# EAGLE design leaf_type_02_rev_01 (EAGLE 7.3.0)
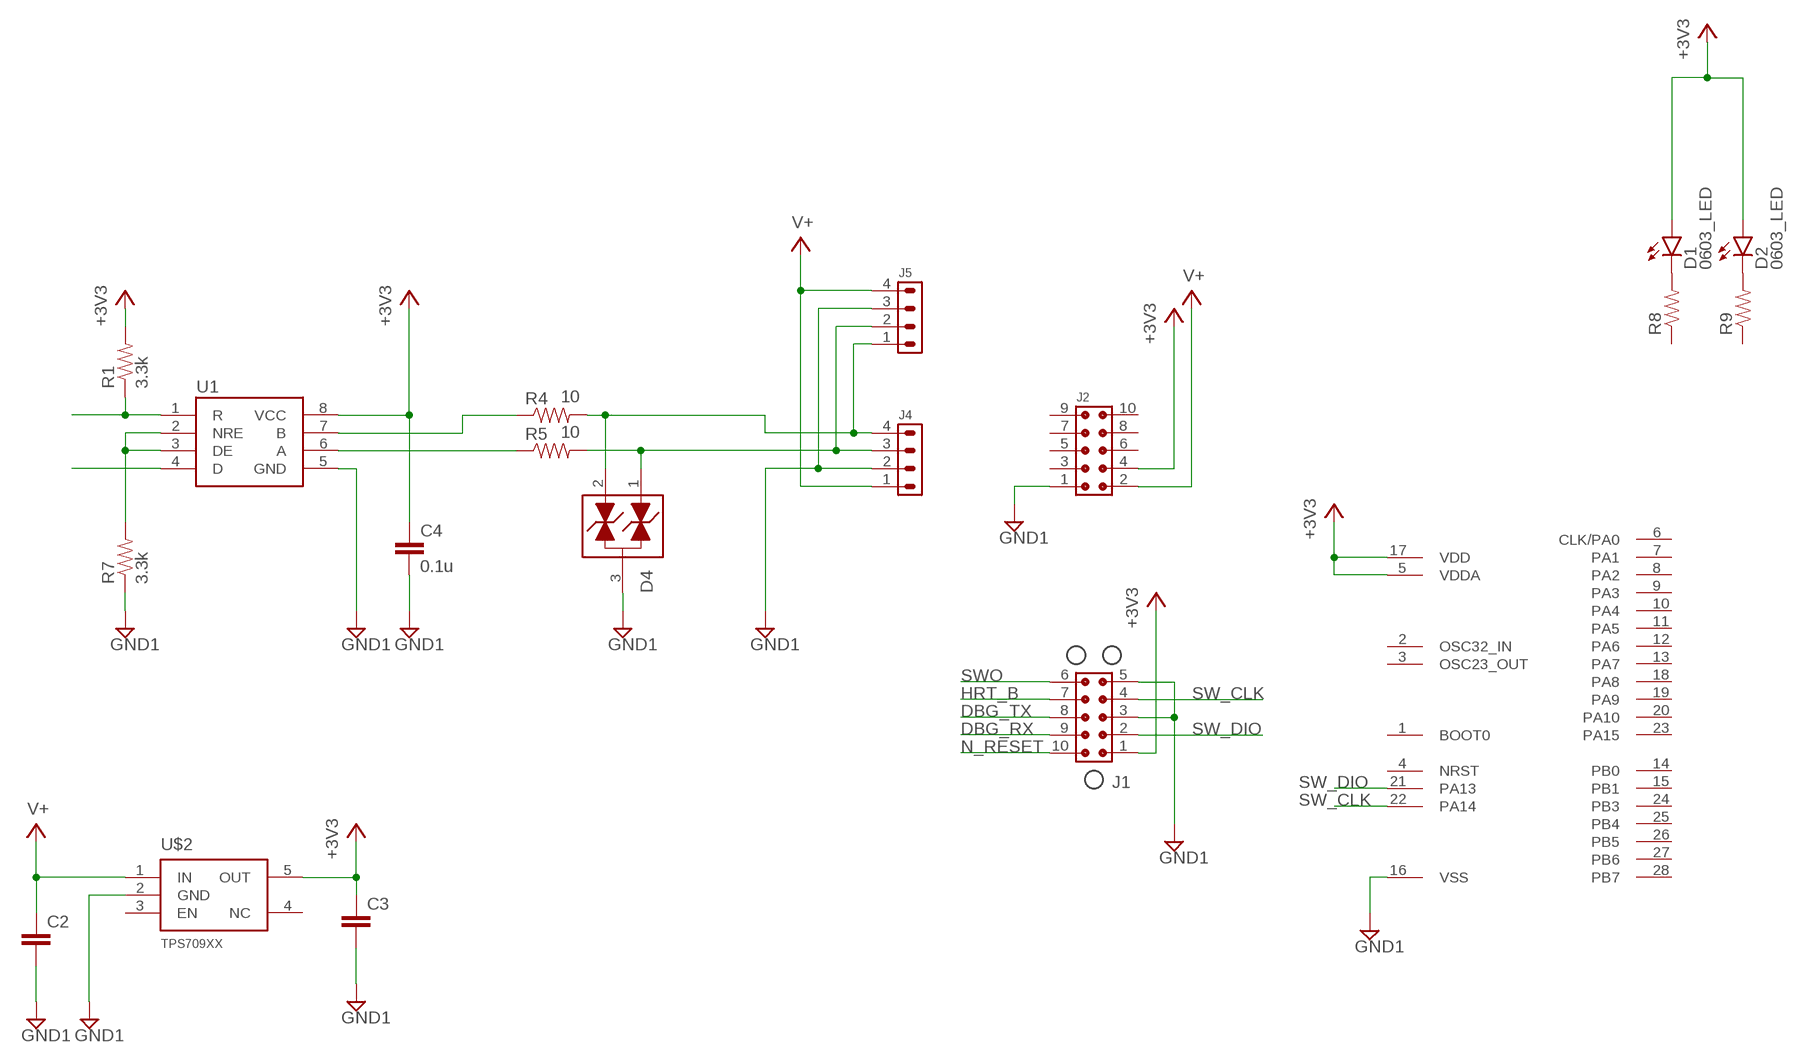
[diagram p0: schematic, sheet 1]

## Parts
C2  0603_CAP  [0603]
C3  0603_CAP  [0603]
C4  0.1u  0603_CAP  [0603]
D1  0603_LED  [0603_LED]
D2  0603_LED  [0603_LED]
D4  TVS_SOT-23  [SOT-23_ONSEMI]
J1  TC_2050_IDC_NL_TOP  [TC_2050_IDC_NL_TOP]
J2  CONN_5X2_0P05_IN_SMT  [CONN_5X2_0P050_IN_SMT]
J4  CONN_4X1_JST_PA  [CONN_4X1_JST_PA]
J5  CONN_4X1_JST_PA  [CONN_4X1_JST_PA]
R1  3.3k  0402_RES  [0402]
R4  10  0603_RES  [0603]
R5  10  0603_RES  [0603]
R7  3.3k  0603_RES  [0603]
R8  0603_RES  [0603]
R9  0603_RES  [0603]
U1  RS485_XCVR_SN65HVD178X  [SOIC_08_TI]
U2  STM32L031G6U6  [STM32_QFN_28_4X4]
U$2  TPS709XX  [SOT23-5]

## Nets
+3V3: C3.P$1 C4.P$1 D1.P$1(A) D2.P$1(A) J1.1 J2.4 R1.P$2 U1.8(VCC) U2.5(VDDA) U2.17(VDD) U$2.5(OUT)
DBG_RX: J1.9
DBG_TX: J1.8
GND1: C2.P$2 C3.P$2 C4.P$2 D4.3 J1.3 J1.5 J2.1 J4.2 J5.3 R7.P$1 U1.5(GND) U2.16(VSS) U$2.2(GND)
HRT_B: J1.7
N$1: D4.2 J4.4 J5.1 R4.P$2
N$2: D1.P$2(C) R8.P$2
N$3: D2.P$2(C) R9.P$2
N$6: R4.P$1 U1.7(B)
N$7: D4.1 J4.3 J5.2 R5.P$2
N$9: R5.P$1 U1.6(A)
N$10: R7.P$2 U1.2(NRE) U1.3(DE)
N$12: R1.P$1 U1.1(R)
N$13: U1.4(D)
N_RESET: J1.10
SW_CLK: J1.4 U2.22(PA14)
SW_DIO: J1.2 U2.21(PA13)
SWO: J1.6
V+: C2.P$1 J2.2 J4.1 J5.4 U$2.1(IN)
Unconnected: J2.3 J2.5 J2.6 J2.7 J2.8 J2.9 J2.10 R8.P$1 R9.P$1 U2.1(BOOT0) U2.2(OSC32_IN) U2.3(OSC23_OUT) U2.4(NRST) U2.6(CLK/PA0) U2.7(PA1) U2.8(PA2) U2.9(PA3) U2.10(PA4) U2.11(PA5) U2.12(PA6) U2.13(PA7) U2.14(PB0) U2.15(PB1) U2.18(PA8) U2.19(PA9) U2.20(PA10) U2.23(PA15) U2.24(PB3) U2.25(PB4) U2.26(PB5) U2.27(PB6) U2.28(PB7) U$2.3(EN) U$2.4(NC)

## Library data of the parts
C2-C4 = stepOSP:0603_CAP
D1 D2 = stepOSP:0603_LED
D4 = leaf:TVS_SOT-23
J1 = leaf:TC_2050_IDC_NL_TOP
J2 = leaf:CONN_5X2_0P05_IN_SMT
J4 J5 = leaf:CONN_4X1_JST_PA
R1 = stepOSP:0402_RES
R4 R5 R7-R9 = stepOSP:0603_RES
U1 = leaf:RS485_XCVR_SN65HVD178X
U2 = leaf:STM32L031G6U6
U$2 = stepOSP:TPS709XX

## Board
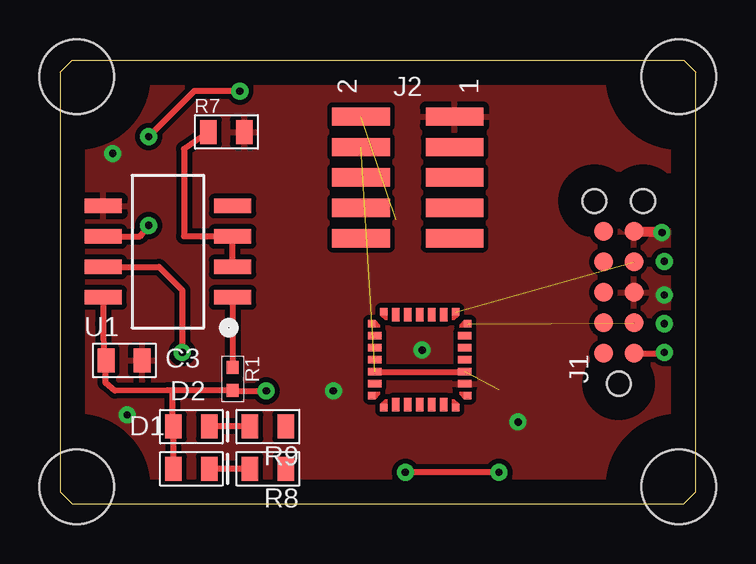
[diagram p1: board, top side]
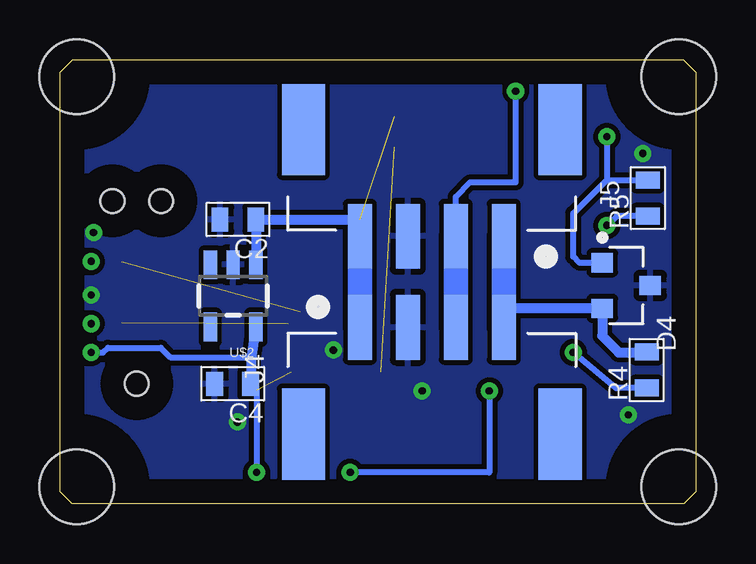
[diagram p2: board, bottom side, seen from below]

Size 26.5 x 18.5 mm. Coordinates in mm from the lower left corner, seen from the top.
Outline: 0,0.5 0.5,0 26,0 26.5,0.5 26.5,18 26,18.5 0.5,18.5 0,18 0,0.5
Copper layers (1*16): Top 0.035mm / dielectric 1.5mm / Bottom 0.035mm
Design rules "default *": minimum track width 10mil, minimum drill 24mil, track to track 8mil, track to pad 8mil, pad to pad 8mil, via to via 8mil, smd to smd 8mil, copper to edge 40mil, drill to drill 8mil, minimum pad ring 10mil, minimum via ring 8mil, stop-mask expansion 4mil, vias tented up to drill 12mil, thermal gap 10mil
Holes 3.1 mm at 25.8,0.7 0.7,17.8 0.7,0.7 25.8,17.8
tRestrict: area -2.3,14.8 to 3.7,20.8; area 22.8,-2.3 to 28.8,3.7; area -2.3,-2.3 to 3.7,3.7; area 22.8,14.8 to 28.8,20.8
bRestrict: area 22.8,14.8 to 28.8,20.8; area 22.8,-2.3 to 28.8,3.7; area -2.3,14.8 to 3.7,20.8; area -2.3,-2.3 to 3.7,3.7

### Footprints (pad centres in the part's own frame; a part is rotated, then mirrored left to right if it is on the bottom)
0603 = smd 0.7 x 1: P$1 -0.75,0; P$2 0.75,0
0603_LED = smd 0.7 x 1: P$1 -0.75,0; P$2 0.75,0
SOT-23_ONSEMI = smd 0.8 x 0.9: 1 -0.95,-1; 2 0.95,-1; 3 0,1
TC_2050_IDC_NL_TOP = smd 0.787 x 0.787: 1 1.27,-0.635; 2 2.54,-0.635; 3 3.81,-0.635; 4 5.08,-0.635; 5 6.35,-0.635; 6 6.35,0.635; 7 5.08,0.635; 8 3.81,0.635; 9 2.54,0.635; 10 1.27,0.635 | hole 0.991: 0,0; 7.62,1.016; 7.62,-1.016
CONN_5X2_0P050_IN_SMT = smd 0.76 x 2.4: 1 -2.54,1.95; 2 -2.54,-1.95; 3 -1.27,1.95; 4 -1.27,-1.95; 5 0,1.95; 6 0,-1.95; 7 1.27,1.95; 8 1.27,-1.95; 9 2.54,1.95; 10 2.54,-1.95
CONN_4X1_JST_PA = smd 1 x 2.7: 1 3,-9.15; 2 1,-9.15; 3 -1,-9.15; 4 -3,-9.15 | smd 1.8 x 3.8: P$1 5.35,-4.7; P$2 -5.35,-4.7
0402 = smd 0.55 x 0.5: P$1 -0.475,0; P$2 0.475,0
SOIC_08_TI = smd 0.6 x 1.55: 1 0,-2.7; 2 1.27,-2.7; 3 2.54,-2.7; 4 3.81,-2.7; 5 3.81,2.7; 6 2.54,2.7; 7 1.27,2.7; 8 0,2.7
STM32_QFN_28_4X4 = smd 0.3 x 0.3: 1 -2,1.5; 7 -2,-1.5; 8 -1.5,-2; 14 1.5,-2; 15 2,-1.5; 21 2,1.5; 22 1.5,2; 28 -1.5,2 | smd 0.55 x 0.3: 2 -1.875,1; 3 -1.875,0.5; 4 -1.875,0; 5 -1.875,-0.5; 6 -1.875,-1; 16 1.875,-1; 17 1.875,-0.5; 18 1.875,0; 19 1.875,0.5; 20 1.875,1 | smd 0.3 x 0.55: 9 -1,-1.875; 10 -0.5,-1.875; 11 0,-1.875; 12 0.5,-1.875; 13 1,-1.875; 23 1,1.875; 24 0.5,1.875; 25 0,1.875; 26 -0.5,1.875; 27 -1,1.875
SOT23-5 = smd 0.55 x 1.2: 1 -0.95,-1.3; 2 0,-1.3; 3 0.95,-1.3; 4 0.95,1.3; 5 -0.95,1.3

### Placement (x,y rotation side)
C2  19.08,11.85 180 bottom
C3  2.68,5.97 0 top
C4  19.3,5 180 bottom
D1  5.48,1.45 0 top
D2  5.48,3.21 0 top
D4  2.89,9.09 270 bottom
J1  23.3,5 90 top
J2  14.5,13.6 270 top
J4  11,-1.8 180 bottom
J5  11,20.3 0 bottom
R1  7.2,5.2 270 top
R4  2.04,5.57 90 bottom
R5  1.99,12.74 90 bottom
R7  6.94,15.5 180 top
R8  8.67,1.45 180 top
R9  8.67,3.21 180 top
U1  4.5,8.6 90 top
U2  15,6 0 top
U$2  19.28,8.66 180 bottom

### Tracks (layer width: path | path; a pad name or v marks a point on that pad's centre or on a via)
+3V3  (via drill 0.3)  (2 unrouted)
  Top 0.254: U1.8 1.8,7.5 1.83,6.07 C3.P$1 1.9,5.04 2.3,4.7 4.47,4.72 4.7,4.72 | 4.7,4.72 R1.P$2 7.22,4.7 v8.6,4.7 | J1.1 25.17,6.27 v25.2,6.3 | 4.8,2.94 D2.P$1 | 4.83,1.35 D1.P$1 D2.P$1 | D2.P$1 4.7,3.14 4.7,4.72 | v18.3,1.3 v14.4,1.3 | U2.5 U2.17
  Bottom 0.254: v25.2,6.3 24.7,6.3 24.5,6.5 22.3,6.5 21.9,6.1 18.59,6.1 18.53,6.04 | C4.P$1 18.3,4.75 v18.3,1.3 | v8.6,4.7 8.6,1.3 v14.4,1.3
  Bottom 0.406: U$2.5 18.35,7.36 18.53,6.04 C4.P$1
GND1  (via drill 0.3)
  Top 0.406: J1.5 25.1,11.35 v25.1,11.3
  other vias: 19.1,3.4 2.2,14.6 25.2,8.7 2.8,3.7 11.4,4.7 15.1,6.4
  pour Bottom: 0,0 26.5,-0.1 26.5,18.5 0,18.5
  pour Top: 0,0 26.5,0 26.5,18.5 0,18.5
N$1
  Bottom 0.406: 8,8.2 7.94,8.14 D4.2 3.89,6.99 3.2,6.3 2.06,6.3 R4.P$2
  Bottom 1.016: J4.4 8,8.2 J5.1
N$2
  Top 0.254: R8.P$2 D1.P$2
N$3
  Top 0.254: R9.P$2 D2.P$2
N$6  (via drill 0.3)
  Top 0.254: U1.7 4.13,9.87 5.1,8.9 v5.1,6.3
  Bottom 0.254: R4.P$1 3.32,4.82 v5.1,6.3
N$7  (via drill 0.3)
  Top 0.254: v7.5,17.2 5.6,17.2 v3.7,15.3
  Bottom 0.254: J5.2 10,12.8 9.4,13.4 7.5,13.4 v7.5,17.2 | D4.1 4.84,10.04 5.1,10.3 5.1,12.1 3.7,13.5 | 3.7,13.5 R5.P$2 | v3.7,15.3 3.7,13.5
  Bottom 1.016: J4.3 J5.2
N$9  (via drill 0.3)
  Top 0.254: U1.6 3.34,11.14 v3.7,11.6
  Bottom 0.254: R5.P$1 3.29,11.99 v3.7,11.6
N$10
  Top 0.254: U1.2 U1.3 5.17,11.14 5.17,14.79 R7.P$2
N$12
  Top 0.254: U1.1 R1.P$1
N$14  (via drill 0.3)
  other vias: 25.2,10.1
N$15  (via drill 0.3)
  other vias: 25.2,7.5
SW_CLK  (1 unrouted)
SW_DIO  (1 unrouted)
V+  (1 unrouted)
  Bottom 0.406: J5.4 14,11.85 C2.P$1 U$2.1
  Bottom 1.016: J4.1 J5.4
(copper drawn outside any net)
  shapes: Top area x3